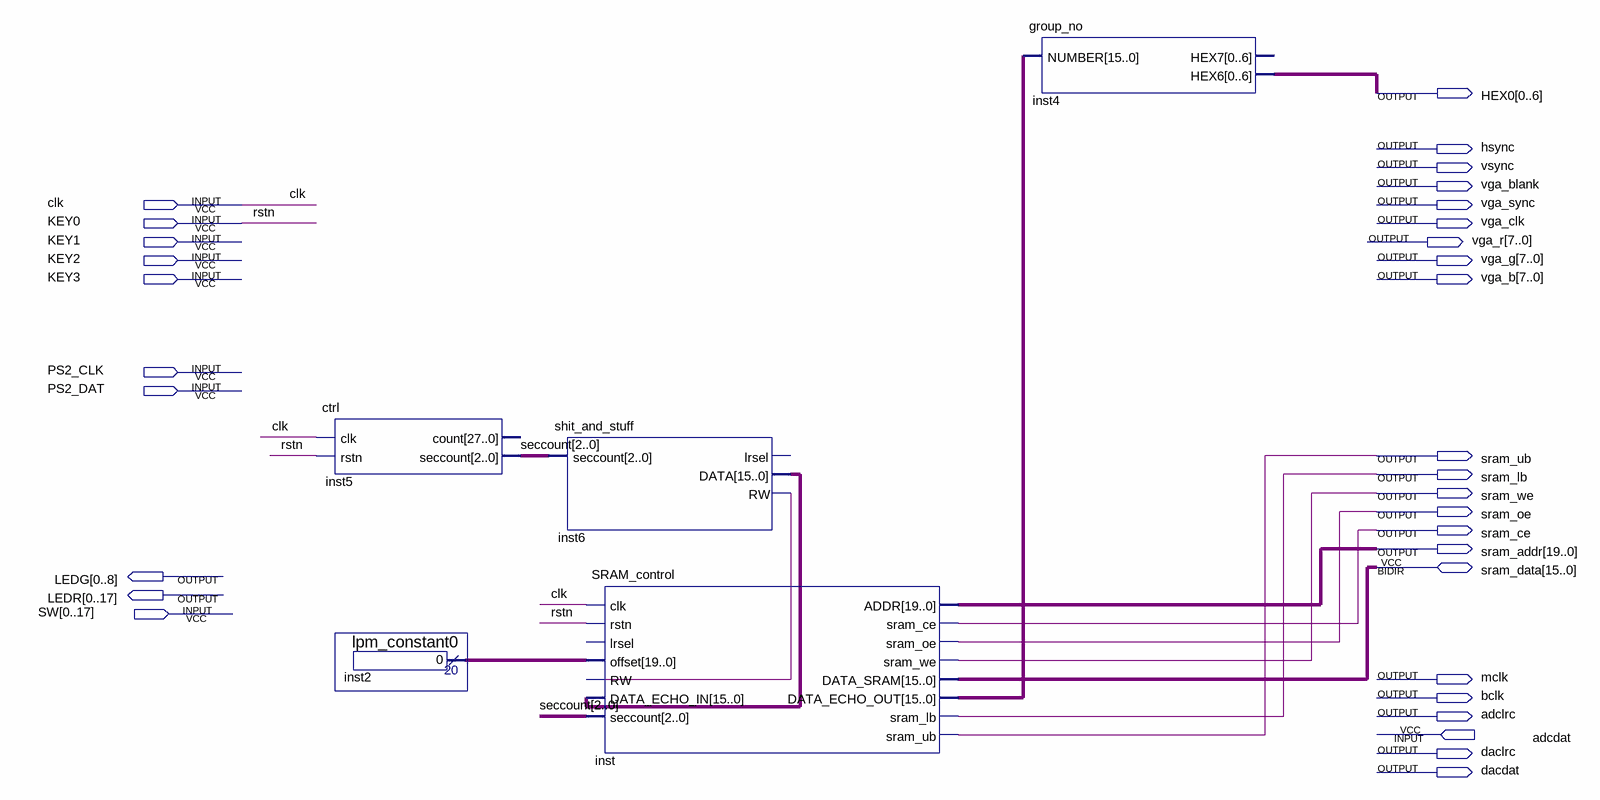
[diagram p0: schematic sheet]
// Quartus schematic Proj.bdf as structural Verilog: 5 symbols, 32 pins
module Proj (
  input  clk,
  input  KEY0,
  input  KEY1,
  input  KEY2,
  input  KEY3,
  input  PS2_CLK,
  input  PS2_DAT,
  input  [0:17] SW,
  input  adcdat,
  inout  [15:0] sram_data,
  output [0:6] HEX0,
  output hsync,
  output vsync,
  output vga_blank,
  output vga_sync,
  output vga_clk,
  output [7:0] vga_r,
  output [7:0] vga_g,
  output [7:0] vga_b,
  output sram_ub,
  output sram_lb,
  output sram_we,
  output sram_oe,
  output sram_ce,
  output [19:0] sram_addr,
  output [0:8] LEDG,
  output [0:17] LEDR,
  output mclk,
  output bclk,
  output adclrc,
  output daclrc,
  output dacdat
);

  wire inst6_rw;
  wire [2:0] seccount;
  wire [15:0] inst6_data, inst_data_echo_out;
  wire [19:0] inst2_result;

  ctrl inst5 (.clk(clk), .rstn(KEY0), .seccount(seccount));  // open: count
  lpm_constant0 inst2 (.result(inst2_result));
  shit_and_stuff inst6 (.seccount(seccount), .DATA(inst6_data), .RW(inst6_rw));  // open: lrsel
  SRAM_control inst (
    .clk(clk), .rstn(KEY0), .offset(inst2_result), .RW(inst6_rw), .DATA_ECHO_IN(inst6_data),
    .seccount(seccount), .ADDR(sram_addr), .sram_ce(sram_ce), .sram_oe(sram_oe), .sram_we(sram_we),
    .DATA_ECHO_OUT(inst_data_echo_out), .sram_lb(sram_lb), .sram_ub(sram_ub), .DATA_SRAM(sram_data));  // open: lrsel
  group_no inst4 (.NUMBER(inst_data_echo_out), .HEX6(HEX0));  // open: HEX7

  // Other names for the same wires on the sheet: rstn = KEY0
endmodule
